# Altium schematic sheet BLOCK_DIAGRAM.SchDoc
size A3; SheetNumber: 1; SheetTotal: 8
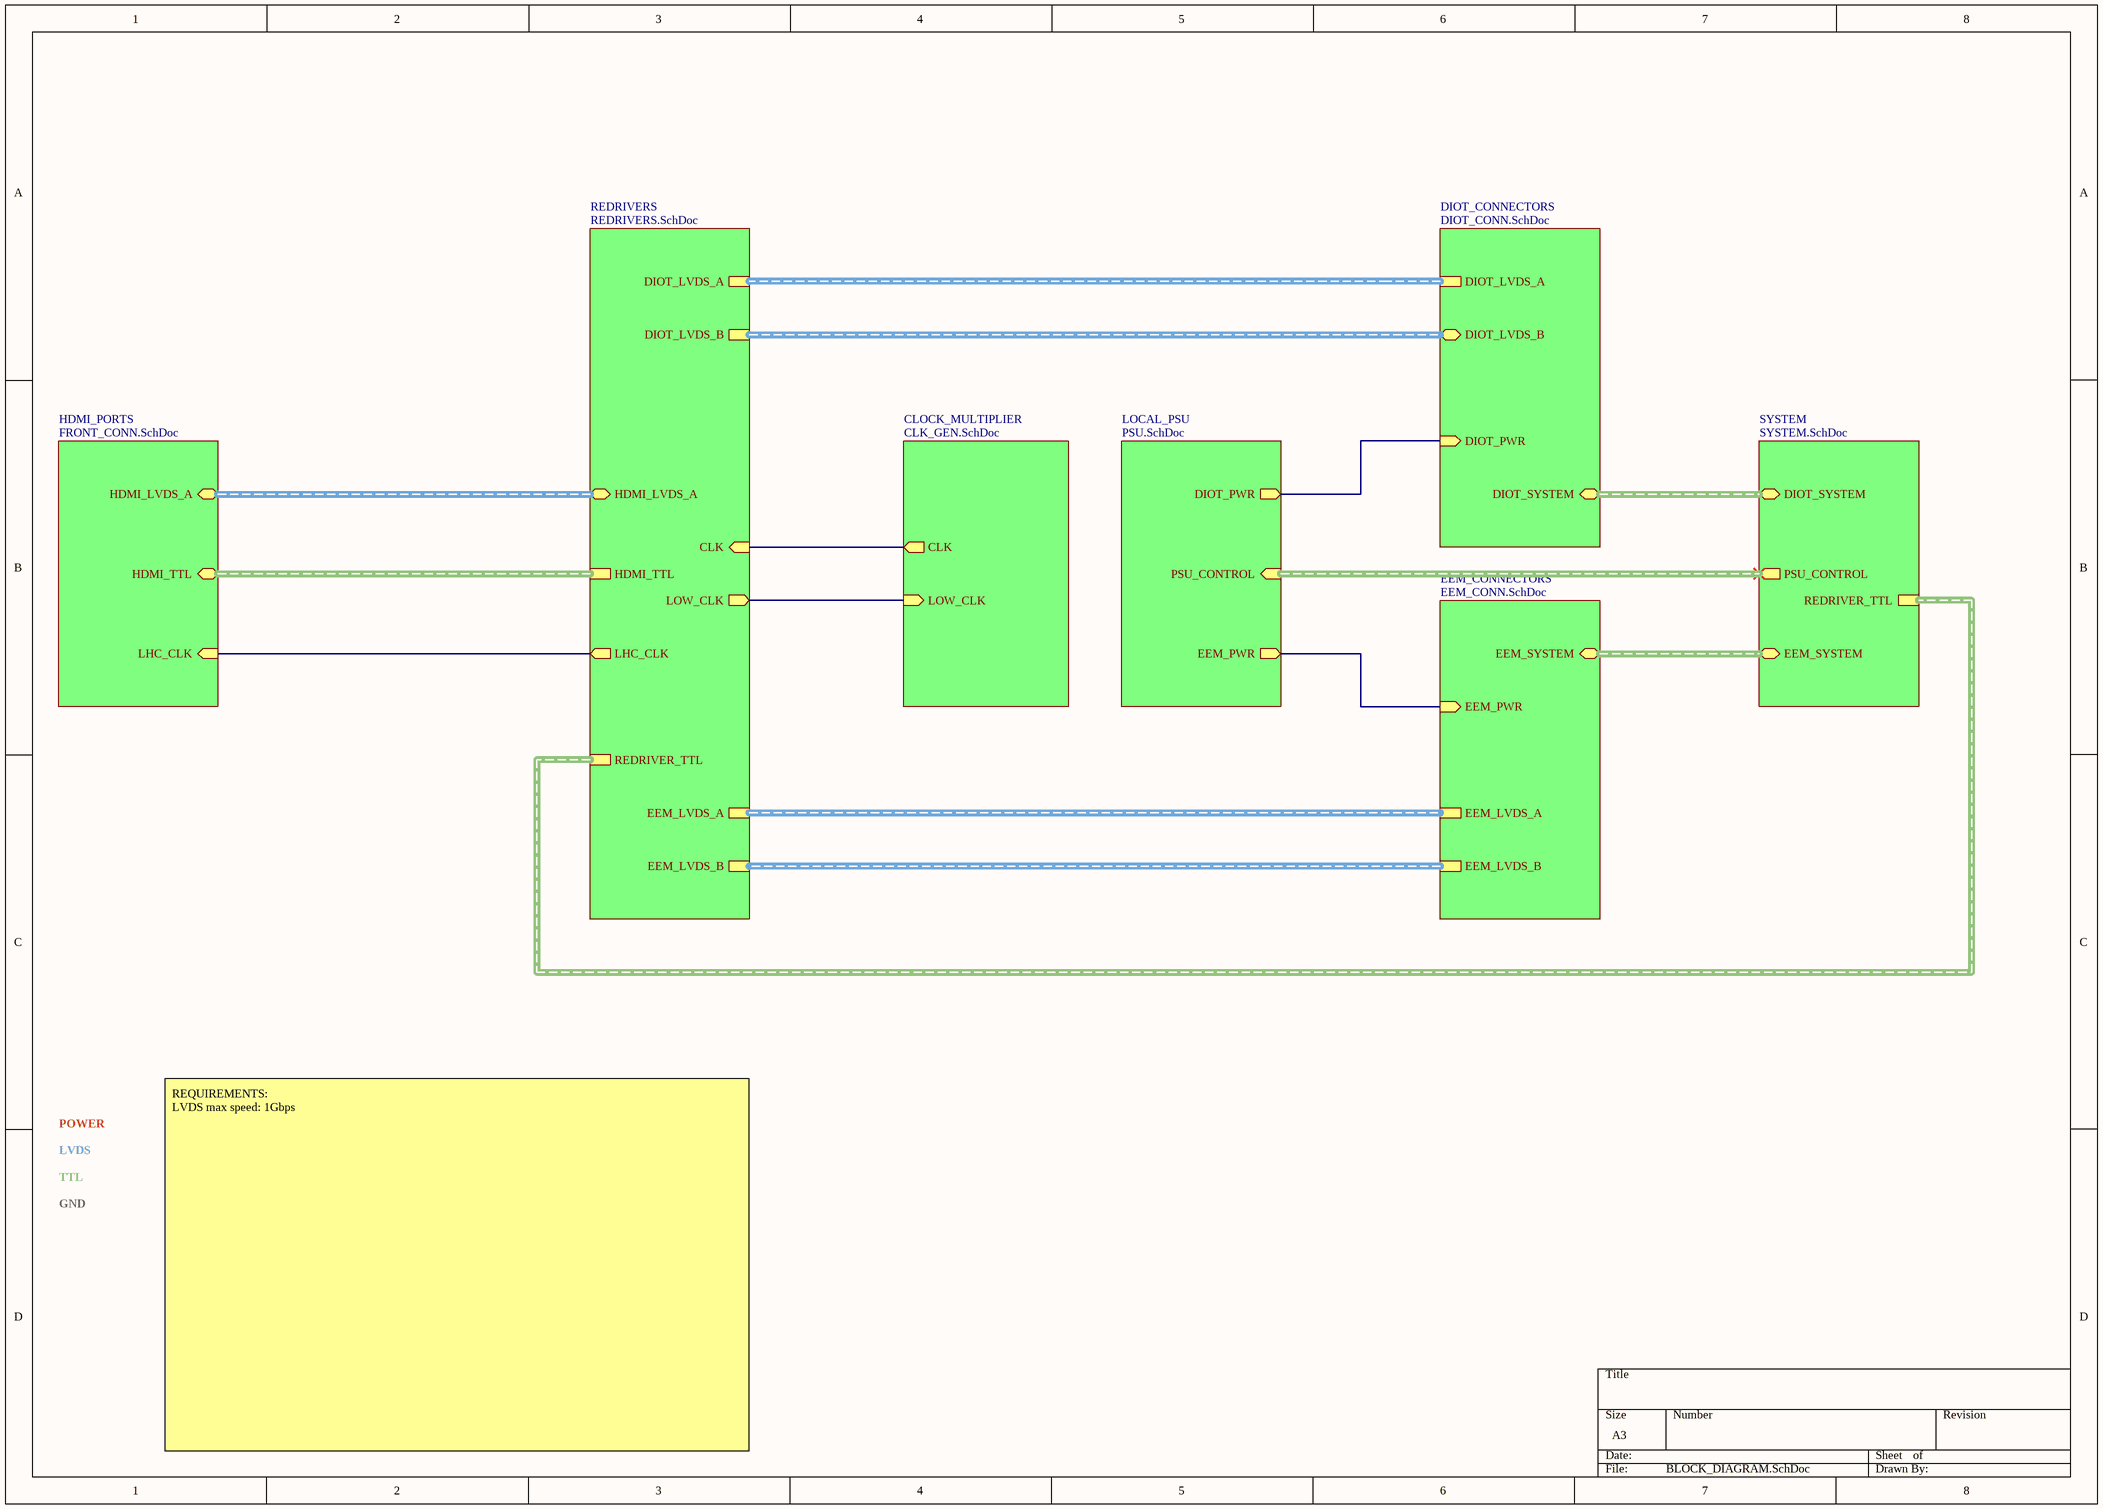
[diagram p0: BLOCK_DIAGRAM.SchDoc]

## Sub-sheets
CLOCK_MULTIPLIER = CLK_GEN.SchDoc: CLK (out), LOW_CLK (in)
DIOT_CONNECTORS = DIOT_CONN.SchDoc: DIOT_SYSTEM (bidir, harness DIOT_SYSTEM), DIOT_LVDS_A (harness DIOT_LVDS_A), DIOT_PWR (in), DIOT_LVDS_B (bidir)
EEM_CONNECTORS = EEM_CONN.SchDoc: EEM_SYSTEM (bidir), EEM_LVDS_B (harness EEM_LVDS), EEM_PWR (in), EEM_LVDS_A (harness EEM_LVDS_A)
HDMI_PORTS = FRONT_CONN.SchDoc: HDMI_LVDS_A (bidir), HDMI_TTL (bidir), LHC_CLK (in)
LOCAL_PSU = PSU.SchDoc: DIOT_PWR (out), EEM_PWR (out), PSU_CONTROL (in)
REDRIVERS = REDRIVERS.SchDoc: EEM_LVDS_B (harness DIOT_LVDS_B), DIOT_LVDS_A (harness DIOT_LVDS_A), HDMI_LVDS_A (bidir), HDMI_TTL, DIOT_LVDS_B (harness DIOT_LVDS_B), EEM_LVDS_A (harness EEM_LVDS_A), REDRIVER_TTL, LHC_CLK (out), CLK (in), LOW_CLK (out)
SYSTEM = SYSTEM.SchDoc: DIOT_SYSTEM (bidir, harness DIOT_SYSTEM), EEM_SYSTEM (bidir), PSU_CONTROL (out), REDRIVER_TTL

## Nets
(unnamed): sheet HDMI_PORTS/LHC_CLK, sheet REDRIVERS/LHC_CLK
(unnamed): sheet REDRIVERS/CLK, sheet CLOCK_MULTIPLIER/CLK
(unnamed): sheet REDRIVERS/LOW_CLK, sheet CLOCK_MULTIPLIER/LOW_CLK
(unnamed): sheet DIOT_CONNECTORS/DIOT_PWR, sheet LOCAL_PSU/DIOT_PWR
(unnamed): sheet EEM_CONNECTORS/EEM_PWR, sheet LOCAL_PSU/EEM_PWR

## Buses and harness runs
harness sheet DIOT_CONNECTORS/DIOT_LVDS_A = sheet REDRIVERS/DIOT_LVDS_A
harness sheet DIOT_CONNECTORS/DIOT_LVDS_B = sheet REDRIVERS/DIOT_LVDS_B
harness sheet DIOT_CONNECTORS/DIOT_SYSTEM = sheet SYSTEM/DIOT_SYSTEM
harness sheet EEM_CONNECTORS/EEM_LVDS_A = sheet REDRIVERS/EEM_LVDS_A
harness sheet EEM_CONNECTORS/EEM_LVDS_B = sheet REDRIVERS/EEM_LVDS_B
harness sheet EEM_CONNECTORS/EEM_SYSTEM = sheet SYSTEM/EEM_SYSTEM
harness sheet HDMI_PORTS/HDMI_LVDS_A = sheet REDRIVERS/HDMI_LVDS_A
harness sheet HDMI_PORTS/HDMI_TTL = sheet REDRIVERS/HDMI_TTL
harness sheet LOCAL_PSU/PSU_CONTROL = sheet SYSTEM/PSU_CONTROL
harness sheet REDRIVERS/REDRIVER_TTL = sheet SYSTEM/REDRIVER_TTL

## Notes on the sheet
- POWER
- LVDS
- TTL
- GND
- REQUIREMENTS:
  LVDS max speed: 1Gbps